# EAGLE design 797 test (EAGLE 5.07)
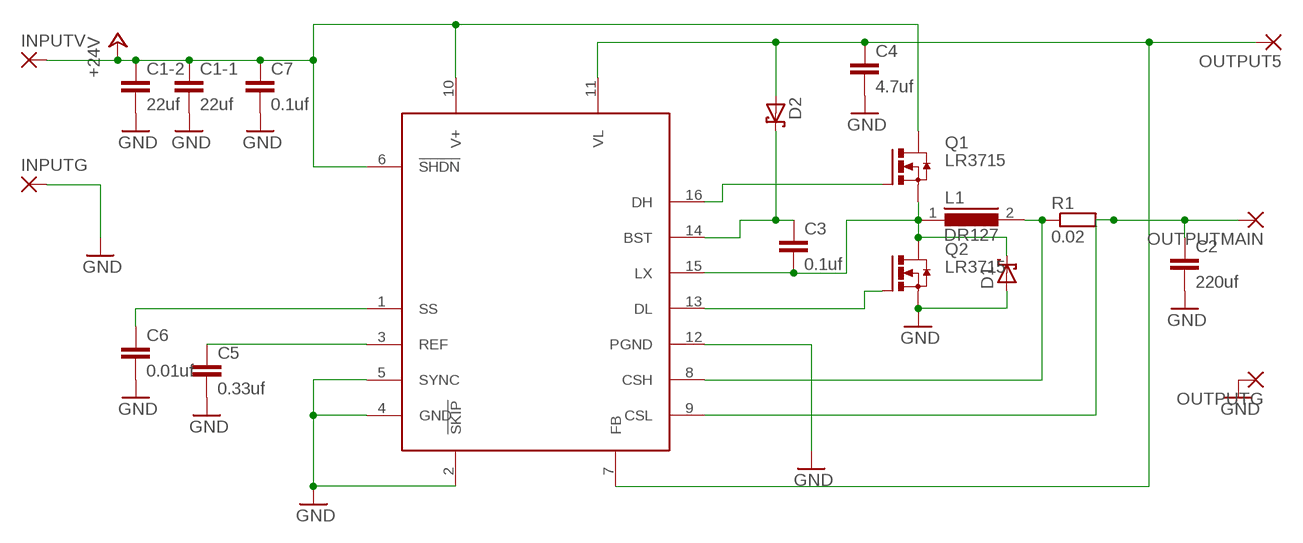
[diagram p0: schematic, sheet 1]

## Parts
C1-1  22uf  C-EU050-030X075  [C050-030X075]
C1-2  22uf  C-EU050-030X075  [C050-030X075]
C2  220uf  C-EU050-030X075  [C050-030X075]
C3  0.1uf  C-EU050-030X075  [C050-030X075]
C4  4.7uf  C-EU050-030X075  [C050-030X075]
C5  0.33uf  C-EU050-030X075  [C050-030X075]
C6  0.01uf  C-EU050-030X075  [C050-030X075]
C7  0.1uf  C-EU050-030X075  [C050-030X075]
D1  SCHOTTKY-DIODEF126Z12  [F126Z12]
D2  SCHOTTKY-DIODEF126Z12  [F126Z12]
INPUTG  3,17/1,3  [3,17/1,3]
INPUTV  3,17/1,3  [3,17/1,3]
L1  DR127  [DR127]
OUTPUT5  3,17/1,3  [3,17/1,3]
OUTPUTG  3,17/1,3  [3,17/1,3]
OUTPUTMAIN  3,17/1,3  [3,17/1,3]
Q1  LR3715  [D-PAK_TO252AA]
Q2  LR3715  [D-PAK_TO252AA]
R1  0.02  R-EU_R6332  [R6332]
U$1  MAX797  [SO16]

## Nets
5V: C4.1 D2.A OUTPUT5.1(P) U$1.7(FB) U$1.11(VL)
+24V: C1-1.1 C1-2.1 C7.1 INPUTV.1(P) Q1.4(D) U$1.6(!SHDN) U$1.10(V+)
GND: C1-1.2 C1-2.2 C2.2 C4.2 C5.2 C6.2 C7.2 D1.A INPUTG.1(P) OUTPUTG.1(P) Q2.3(S) U$1.2(!SKIP) U$1.4(GND) U$1.5(SYNC) U$1.12(PGND)
N$1: C3.1 D2.C U$1.14(BST)
N$2: L1.2 R1.1 U$1.8(CSH)
N$4: C3.2 D1.C L1.1 Q1.3(S) Q2.4(D) U$1.15(LX)
N$6: C5.1 U$1.3(REF)
N$7: C6.1 U$1.1(SS)
N$8: Q2.1(G) U$1.13(DL)
N$10: Q1.1(G) U$1.16(DH)
OUTPUT: C2.1 OUTPUTMAIN.1(P) R1.2 U$1.9(CSL)

## Library data of the parts
C1-1 C1-2 C2-C7 = matt rcl:C-EU: CAPACITOR, European symbol
D1 D2 = adafruit:SCHOTTKY-DIODE: Schottky Diode
INPUTG INPUTV OUTPUT5 OUTPUTG OUTPUTMAIN = wirepad:3,17/1,3: THROUGH-HOLE PAD
L1 = inductors:DR127: High Power Density, High Efficiency, Shielded Inductors Source: coiltronics_dr_series.pdf
Q1 Q2 = matt-transistor-power:LR3715
R1 = resistor:R-EU_: RESISTOR, European symbol
U$1 = matt smd-special:MAX797: maxim dc/dc converter

## Board
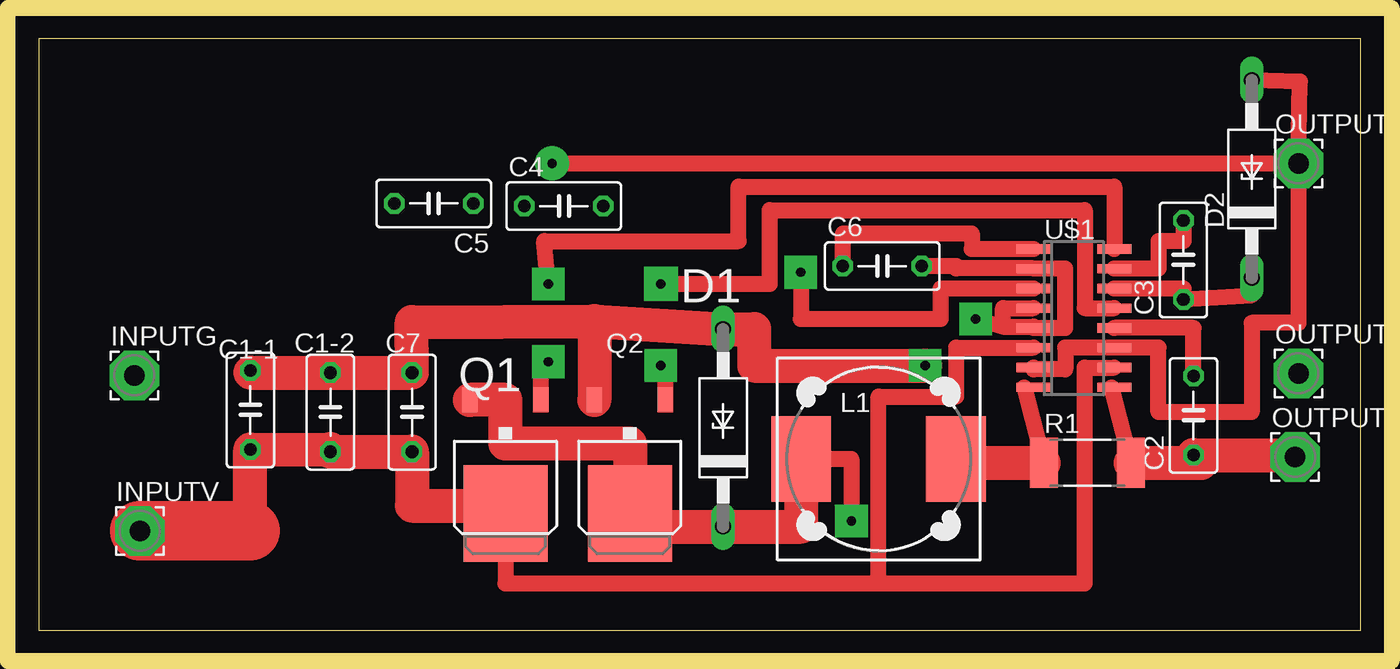
[diagram p1: board, top side]
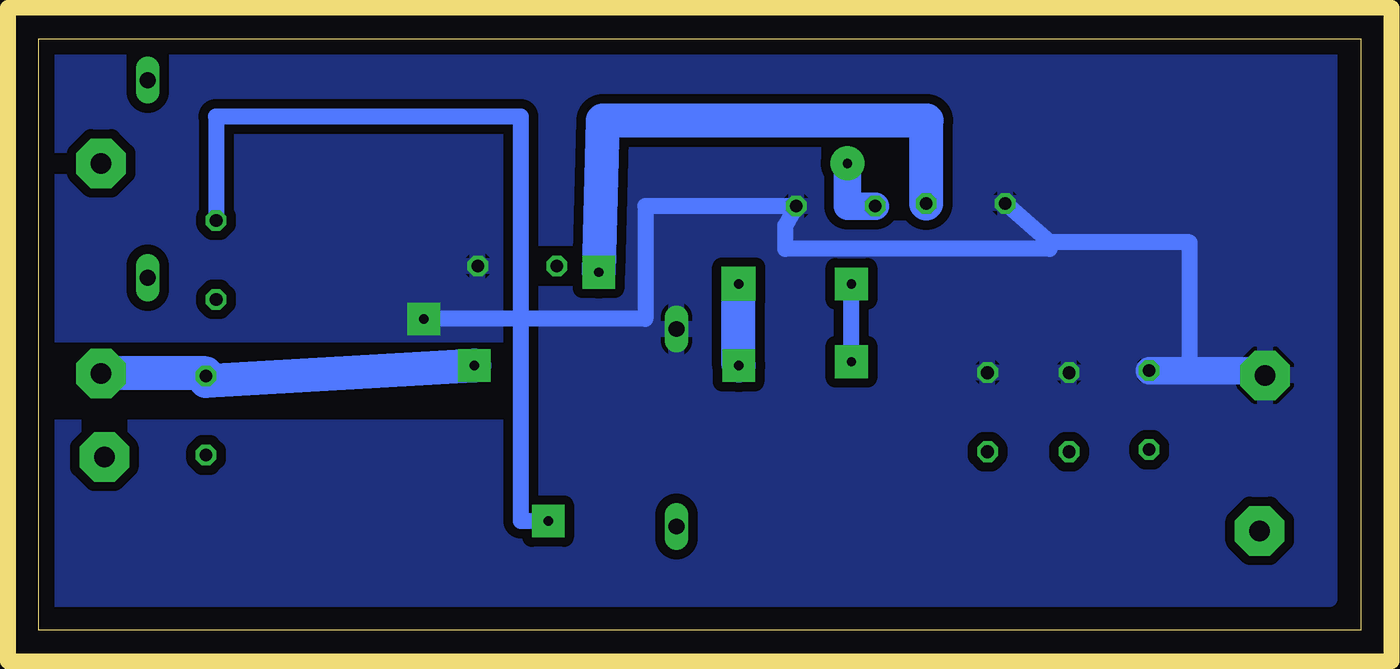
[diagram p2: board, bottom side, seen from below]

Size 85 x 38 mm. Coordinates in mm from the lower left corner, seen from the top.
Outline: 0,0 85,0 85,38 0,38 0,0
Copper layers (1*16): Top 0.035mm / dielectric 1.5mm / Bottom 0.035mm
Design rules "default *": minimum track width 10mil, minimum drill 24mil, track to track 8mil, track to pad 8mil, pad to pad 8mil, via to via 8mil, smd to smd 8mil, copper to edge 40mil, drill to drill 8mil, minimum pad ring 10mil, minimum via ring 0.75mm, stop-mask expansion 4mil, vias tented up to drill 0mil, thermal gap 10mil
Holes 1 mm at -3,-3 87,-3
Milling: 4 lines

### Footprints (pad centres in the part's own frame; a part is rotated, then mirrored left to right if it is on the bottom)
C050-030X075 = drill 0.813 octagon: 1 -2.54,0; 2 2.54,0
F126Z12 = drill 1.016 long: A 6.35,0; C -6.35,0
3,17/1,3 = drill 1.321 pad 3.175 octagon: 1 0,0
DR127 = smd 3.85 x 5.5: 1 -4.975,0; 2 4.975,0
D-PAK_TO252AA = smd 1 x 1.6: 1 -2.28,-4.8; 3 2.28,-4.8 | smd 5.4 x 6.2: 4 0,2.5
R6332 = smd 1.8 x 3.2: 1 -2.8,0; 2 2.8,0
SO16 = smd 0.6 x 2.2: 1 -9.525,-4.6; 2 -8.255,-4.6; 3 -6.985,-4.6; 4 -5.715,-4.6; 5 -4.445,-4.6; 6 -3.175,-4.6; 7 -1.905,-4.6; 8 -0.635,-4.6; 9 -0.635,0.6; 10 -1.905,0.6; 11 -3.175,0.6; 12 -4.445,0.6; 13 -5.715,0.6; 14 -6.985,0.6; 15 -8.255,0.6; 16 -9.525,0.6

### Placement (x,y rotation side)
C1-1  13.6,14.14 90 top
C1-2  18.75,14 90 top
C2  74.25,13.79 90 top
C3  73.6,23.79 90 top
C4  33.75,27.25 0 top
C5  25.39,27.42 180 top
C6  54.24,23.4 0 top
C7  24,14 90 top
D1  44,13 90 top
D2  78,29 90 top
INPUTG  6.14,16.37 0 top
INPUTV  6.49,6.37 0 top
L1  54,11 0 top
OUTPUT5  81,30 0 top
OUTPUTG  81,16.5 0 top
OUTPUTMAIN  80.79,11.12 0 top
Q1  30,10 180 top
Q2  38,10 180 top
R1  67.42,10.75 0 top
U$1  68.56,14.97 270 top

### Tracks (layer width: path | path; a pad name or v marks a point on that pad's centre or on a via)
5V  (via drill 0.6 pad 2.18)
  Top 1.016: D2.A 81.1,35.25 OUTPUT5.1 | v33,30 OUTPUT5.1 | OUTPUT5.1 81,19.75 78,19.75 78,14 72,14 72,18.14 U$1.11 66,18.14 66,16.75 63.96,16.75 U$1.7
  Bottom 1.778: C4.1 33,27.25 v33,30
+24V
  Top 0.406: 18.75,11.62 C1-2.1
  Top 1.016: Q1.4 30,3 54,3 | U$1.6 59,18.14 59,15 54,15 54,3 | U$1.10 67.25,16.88 67.25,3 54,3
  Top 2.184: 18.75,11.62 C1-1.1 13.6,6.37 | C1-2.1 C7.1 24,8 30,8 Q1.4
  Top 3.81: INPUTV.1 13.6,6.37
GND  (via drill 0.6)
  Top 0.406: 63.96,19.5 U$1.5
  Top 1.016: 62,19.5 63.96,19.5 | U$1.5 66,19.41 66,23.23 U$1.2 63.96,23.25 59,23.25 59,23.4 C6.2 | U$1.12 74.25,19.41 C2.2 | U$1.4 62,20.68 62,19.5 | C1-1.2 13.6,16.54 | v60.25,20 62,19.5
  Top 2.184: 13.6,16.54 C1-2.2 C7.2 23.97,19.79 35.72,19.85 | 35.72,19.85 D1.A 46,19.35 46,17 v57,17 | 35.72,19.85 Q2.3
  Bottom 0.406: C1-1.2 13.6,16.54 | INPUTG.1 6.14,16.68
  Bottom 1.016: 74.25,16 C2.2 74.25,16.5 | 20,24.92 11,24.92 11,16.68 | 20,24.92 C5.2 | 20,24.92 20,24.5 37,24.5 37,26 C4.2 46,27.25 46,20 v60.25,20
  Bottom 1.778: 6.14,16.68 11,16.68 C1-1.2
  Bottom 2.184: v57,17 74.25,16 | 74.25,16.5 OUTPUTG.1
  pour Bottom (isolate 0.61): 2,37 84,37 84,19 54,19 54,13 84,13 84,2 2,2
N$1
  Top 0.406: 73.6,21.95 C3.1 | 78,21.52 D2.C
  Top 1.016: U$1.14 73.6,21.95 | C3.1 78,21.52
N$2
  Top 0.406: L1.2 58.98,10.75 | 63.37,15.61 U$1.8
  Top 1.016: R1.1 63.37,15.61
  Top 2.184: 58.98,10.75 R1.1
N$4  (via drill 0.6)
  Top 0.406: L1.1 48,11 | 38,6.65 38,7 39,7 39,8 38,8 Q2.4
  Top 1.016: U$1.15 72,23.23 72,25 73.6,25 C3.2 | L1.1 52.25,11 v52.25,7
  Top 2.184: Q1.3 30,14.8 30,12 38,12 Q2.4 | 38,6.65 D1.C 49.02,6.65 L1.1
  Bottom 1.016: v52.25,7 54,7 54,33 73.6,33 C3.2
N$6  (via drill 0.6)
  Top 1.016: U$1.3 58,21.95 58,20 49,20 v49,23
  Bottom 2.184: v49,23 48.75,32.75 27.91,32.75 C5.1
N$7
  Top 1.016: U$1.1 60,24.5 60,25.5 51.72,25.5 C6.1
N$8  (via drill 0.6, 0.6 pad 2.18)
  Top 0.305: 40,15 40.28,15 Q2.1
  Top 1.016: U$1.13 67.25,20.68 67.25,27 47,27 47,22.25 v40,22.25 | v40,17 40.28,17 Q2.1
  Bottom 2.184: v40,17 v40,22.25
N$10  (via drill 0.6)
  Top 1.016: U$1.16 69.16,28.5 45,28.5 45,25 32.5,25 v32.75,22.25 | v32.75,17.25 32.28,16.75 Q1.1
  Bottom 1.016: v32.75,17.25 v32.75,22.25
OUTPUT
  Top 0.406: 74.75,10.75 C2.1 | 80.79,11.23 OUTPUTMAIN.1 | 68.97,15.61 U$1.9
  Top 1.016: R1.2 68.97,15.61
  Top 2.184: R1.2 74.75,10.75 | C2.1 80.79,11.23